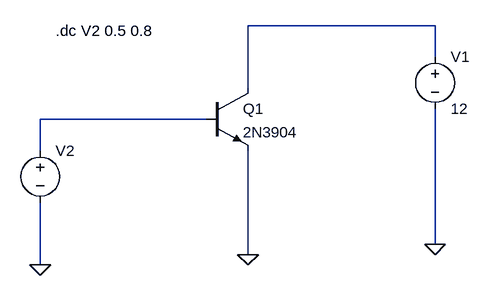
[diagram p0: schematic NPN_Ic_vs_Vbe_trace.asc]
NPN_Ic_vs_Vbe_trace.asc, the LTspice schematic file:
Version 4
SHEET 1 880 680
WIRE 624 224 336 224
WIRE 624 272 624 224
WIRE 336 320 336 224
WIRE 272 368 16 368
WIRE 16 416 16 368
WIRE 624 560 624 352
WIRE 336 576 336 416
WIRE 16 592 16 496
FLAG 336 576 0
FLAG 16 592 0
FLAG 624 560 0
SYMBOL npn 272 320 R0
SYMATTR InstName Q1
SYMATTR Value 2N3904
SYMBOL voltage 624 256 R0
SYMATTR InstName V1
SYMATTR Value 12
SYMBOL voltage 16 400 R0
SYMATTR InstName V2
SYMATTR Value ""
TEXT 40 232 Left 2 !.dc V2 0.5 0.8

The netlist it stands for:
* NPN_Ic_vs_Vbe_trace.asc
Q1 N001 N002 0 0 2N3904
V1 N001 0 12
V2 N002 0
.model NPN NPN
.model PNP PNP
.lib standard.bjt
.dc V2 0.5 0.8
.backanno
.end